# EAGLE design power (EAGLE 6.4)
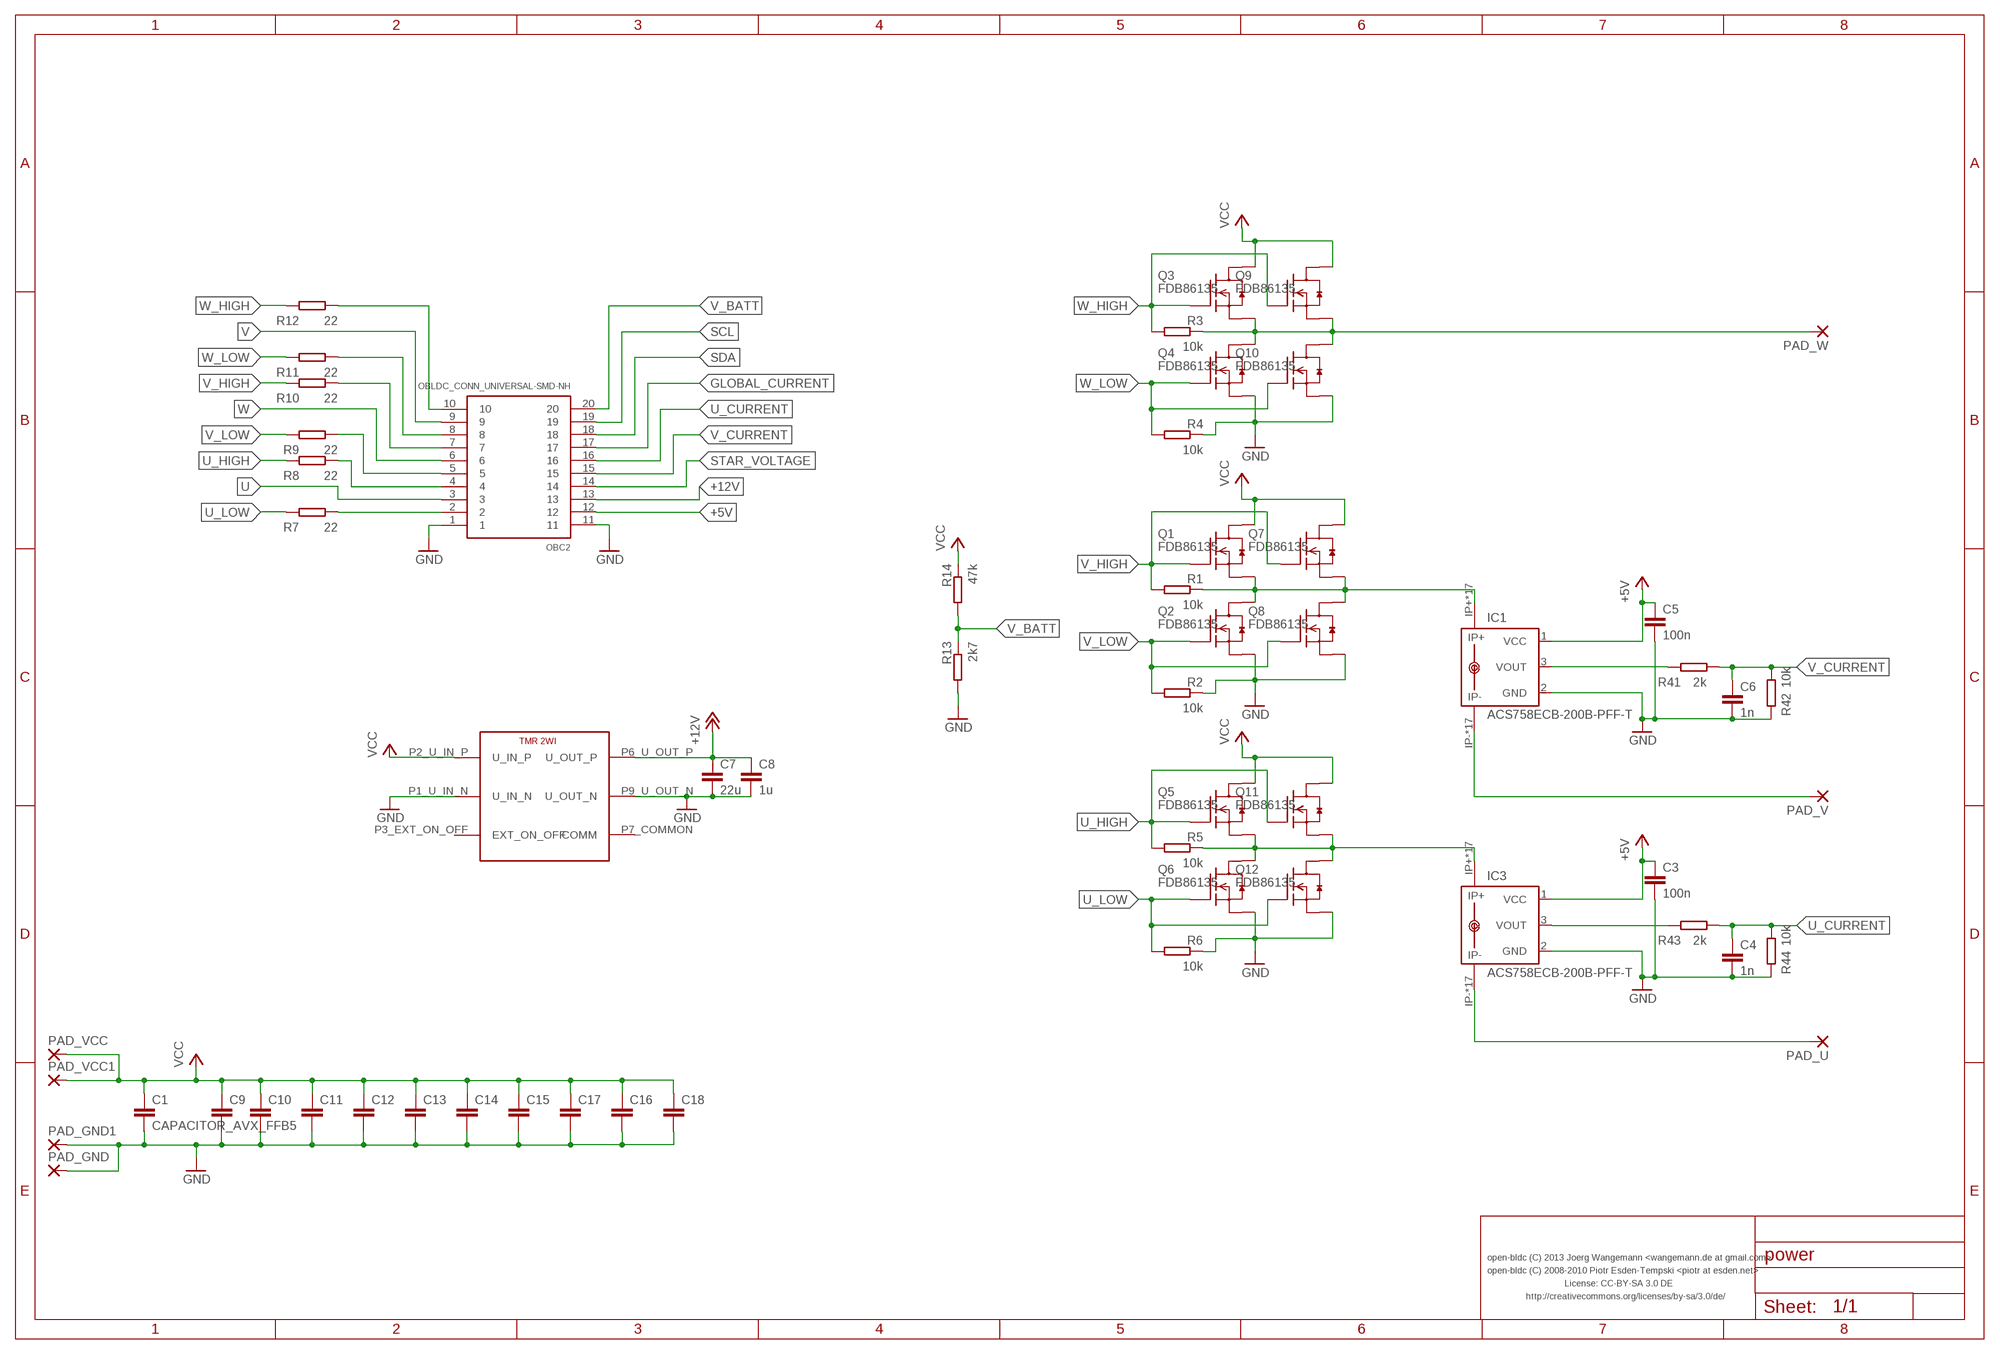
[diagram p0: schematic, sheet 1]

## Parts
C1  CAPACITOR_AVX_FFB5  [AVX_FFB5]
C3  100n  CAPACITOR-0603  [0603-CAP]
C4  1n  CAPACITOR-0603  [0603-CAP]
C5  100n  CAPACITOR-0603  [0603-CAP]
C6  1n  CAPACITOR-0603  [0603-CAP]
C7  22u  C-EUC2220K  [C2220K]
C8  1u  C-EUC1206  [C1206]
C9  C-EUC2220K  [C2220K]
C10  C-EUC2220K  [C2220K]
C11  C-EUC2220K  [C2220K]
C12  C-EUC2220K  [C2220K]
C13  C-EUC2220K  [C2220K]
C14  C-EUC2220K  [C2220K]
C15  C-EUC2220K  [C2220K]
C16  C-EUC2220K  [C2220K]
C17  C-EUC2220K  [C2220K]
C18  C-EUC2220K  [C2220K]
IC1  ACS758ECB-200B-PFF-T  [CB-PFF]
IC3  ACS758ECB-200B-PFF-T  [CB-PFF]
OBC2  OBLDC_CONN_UNIVERSAL-SMD-NH  [OBLDC_CONN_SMD_NO_HOLES]
PAD_GND  WIREPAD-2MM  [WIREPAD_2MM]
PAD_GND1  WIREPAD-2MM  [WIREPAD_2MM]
PAD_U  WIREPAD-2MM  [WIREPAD_2MM]
PAD_V  WIREPAD-2MM  [WIREPAD_2MM]
PAD_VCC  WIREPAD-2MM  [WIREPAD_2MM]
PAD_VCC1  WIREPAD-2MM  [WIREPAD_2MM]
PAD_W  WIREPAD-2MM  [WIREPAD_2MM]
Q1  FDB86135  [DPAK]
Q2  FDB86135  [DPAK]
Q3  FDB86135  [DPAK]
Q4  FDB86135  [DPAK]
Q5  FDB86135  [DPAK]
Q6  FDB86135  [DPAK]
Q7  FDB86135  [DPAK]
Q8  FDB86135  [DPAK]
Q9  FDB86135  [DPAK]
Q10  FDB86135  [DPAK]
Q11  FDB86135  [DPAK]
Q12  FDB86135  [DPAK]
R1  10k  RESISTOR-0603SF  [0603-SF-RES]
R2  10k  RESISTOR-0603SF  [0603-SF-RES]
R3  10k  RESISTOR-0603SF  [0603-SF-RES]
R4  10k  RESISTOR-0603SF  [0603-SF-RES]
R5  10k  RESISTOR-0603SF  [0603-SF-RES]
R6  10k  RESISTOR-0603SF  [0603-SF-RES]
R7  22  RESISTOR-1206  [1206-RES]
R8  22  RESISTOR-1206  [1206-RES]
R9  22  RESISTOR-1206  [1206-RES]
R10  22  RESISTOR-1206  [1206-RES]
R11  22  RESISTOR-1206  [1206-RES]
R12  22  RESISTOR-1206  [1206-RES]
R13  2k7  RESISTOR-1206  [1206-RES]
R14  47k  RESISTOR-1206  [1206-RES]
R41  2k  RESISTOR-0603  [0603-RES]
R42  10k  RESISTOR-0603  [0603-RES]
R43  2k  RESISTOR-0603  [0603-RES]
R44  10k  RESISTOR-0603  [0603-RES]
U$2  TRACO_TMR_2WI  [TRACO_TMR_2WI]

## Nets
+5V: C3.P$1 C5.P$1 IC1.1(VCC) IC3.1(VCC) OBC2.12
+12V: C7.1 C8.1 OBC2.13 U$2.P6_U_OUT_P(U_OUT_P)
GLOBAL_CURRENT: OBC2.17
GND: C1.P$2 C3.P$2 C4.P$2 C5.P$2 C6.P$2 C7.2 C8.2 C9.2 C10.2 C11.2 C12.2 C13.2 C14.2 C15.2 C16.2 C17.2 C18.2 IC1.2(GND) IC3.2(GND) OBC2.1 OBC2.11 PAD_GND1.1(P) PAD_GND.1(P) Q2.3(S) Q4.3(S) Q6.3(S) Q8.3(S) Q10.3(S) Q12.3(S) R2.1 R4.1 R6.1 R13.P$2 R42.P$2 R44.P$2 U$2.P1_U_IN_N(U_IN_N) U$2.P9_U_OUT_N(U_OUT_N)
N$2: IC1.3(VOUT) R41.P$2
N$4: OBC2.2 R7.P$1
N$5: OBC2.4 R8.P$1
N$6: OBC2.5 R9.P$1
N$7: OBC2.7 R10.P$1
N$8: OBC2.8 R11.P$1
N$9: OBC2.10 R12.P$1
N$12: IC3.3(VOUT) R43.P$2
SCL: OBC2.19
SDA: OBC2.18
STAR_VOLTAGE: OBC2.14
U: IC3.IP+ IC3.IP+@2(IP+) IC3.IP+@3(IP+) IC3.IP+@4(IP+) IC3.IP+@5(IP+) IC3.IP+@6(IP+) IC3.IP+@7(IP+) IC3.IP+@8(IP+) IC3.IP+@9(IP+) IC3.IP+@10(IP+) IC3.IP+@11(IP+) IC3.IP+@12(IP+) IC3.IP+@13(IP+) IC3.IP+@14(IP+) IC3.IP+@15(IP+) IC3.IP+@16(IP+) IC3.IP+@17(IP+) OBC2.3 Q5.3(S) Q6.P$1(D) Q11.3(S) Q12.P$1(D) R5.1
U_CURRENT: C4.P$1 OBC2.16 R43.P$1 R44.P$1
U_HIGH: Q5.1(G) Q11.1(G) R5.2 R8.P$2
U_LOW: Q6.1(G) Q12.1(G) R6.2 R7.P$2
U_PAD: IC3.IP- IC3.IP-@2(IP-) IC3.IP-@3(IP-) IC3.IP-@4(IP-) IC3.IP-@5(IP-) IC3.IP-@6(IP-) IC3.IP-@7(IP-) IC3.IP-@8(IP-) IC3.IP-@9(IP-) IC3.IP-@10(IP-) IC3.IP-@11(IP-) IC3.IP-@12(IP-) IC3.IP-@13(IP-) IC3.IP-@14(IP-) IC3.IP-@15(IP-) IC3.IP-@16(IP-) IC3.IP-@17(IP-) PAD_U.1(P)
V: IC1.IP+ IC1.IP+@2(IP+) IC1.IP+@3(IP+) IC1.IP+@4(IP+) IC1.IP+@5(IP+) IC1.IP+@6(IP+) IC1.IP+@7(IP+) IC1.IP+@8(IP+) IC1.IP+@9(IP+) IC1.IP+@10(IP+) IC1.IP+@11(IP+) IC1.IP+@12(IP+) IC1.IP+@13(IP+) IC1.IP+@14(IP+) IC1.IP+@15(IP+) IC1.IP+@16(IP+) IC1.IP+@17(IP+) OBC2.9 Q1.3(S) Q2.P$1(D) Q7.3(S) Q8.P$1(D) R1.1
V_BATT: OBC2.20 R13.P$1 R14.P$2
V_CURRENT: C6.P$1 OBC2.15 R41.P$1 R42.P$1
V_HIGH: Q3.1(G) Q9.1(G) R3.2 R10.P$2
V_LOW: Q4.1(G) Q10.1(G) R4.2 R9.P$2
V_PAD: IC1.IP- IC1.IP-@2(IP-) IC1.IP-@3(IP-) IC1.IP-@4(IP-) IC1.IP-@5(IP-) IC1.IP-@6(IP-) IC1.IP-@7(IP-) IC1.IP-@8(IP-) IC1.IP-@9(IP-) IC1.IP-@10(IP-) IC1.IP-@11(IP-) IC1.IP-@12(IP-) IC1.IP-@13(IP-) IC1.IP-@14(IP-) IC1.IP-@15(IP-) IC1.IP-@16(IP-) IC1.IP-@17(IP-) PAD_V.1(P)
VCC: C1.P$1 C9.1 C10.1 C11.1 C12.1 C13.1 C14.1 C15.1 C16.1 C17.1 C18.1 PAD_VCC1.1(P) PAD_VCC.1(P) Q1.P$1(D) Q3.P$1(D) Q5.P$1(D) Q7.P$1(D) Q9.P$1(D) Q11.P$1(D) R14.P$1 U$2.P2_U_IN_P(U_IN_P)
W: OBC2.6 PAD_W.1(P) Q3.3(S) Q4.P$1(D) Q9.3(S) Q10.P$1(D) R3.1
W_HIGH: Q1.1(G) Q7.1(G) R1.2 R12.P$2
W_LOW: Q2.1(G) Q8.1(G) R2.2 R11.P$2
Unconnected: U$2.P3_EXT_ON_OFF(EXT_ON_OFF) U$2.P7_COMMON(COMM)

## Notes on the sheet
- open-bldc (C) 2013 Joerg Wangemann <wangemann.de at gmail.com>
- open-bldc (C) 2008-2010 Piotr Esden-Tempski <piotr at esden.net>
- License: CC-BY-SA 3.0 DE
- http://creativecommons.org/licenses/by-sa/3.0/de/

## Library data of the parts
C1 = open-bldc:CAPACITOR_AVX_FFB5
C3-C6 = pel_dipol_comp:CAPACITOR
C7-C18 = rcl:C-EU: CAPACITOR, European symbol
IC1 IC3 = allegro:ACS758*: Thermally Enhanced, Fully Integrated, Hall Effect-Based Linear Current Sensor with 100 micro Ohm Current Conductor display layer 49 Reference in BRD and place VIAs on circles Source: http://www.allegromicro.com/en/Products/Part_Numbers/0758/0758.pdf; MPN: ACS758ECB-200B-PFF-T; OC_FARNELL: 1718993; OC_NEWARK: 04R7127
OBC2 = open-bldc:OBLDC_CONN_UNIVERSAL
PAD_GND PAD_GND1 PAD_U PAD_V PAD_VCC PAD_VCC1 PAD_W = open-bldc:WIREPAD: THROUGH-HOLE PAD
Q1-Q12 = open-bldc:FDB86135
R1-R14 R41-R44 = pel_dipol_comp:RESISTOR
U$2 = open-bldc:TRACO_TMR_2WI: DC/DC Converter TRACO TMR 2WI Series

## Board
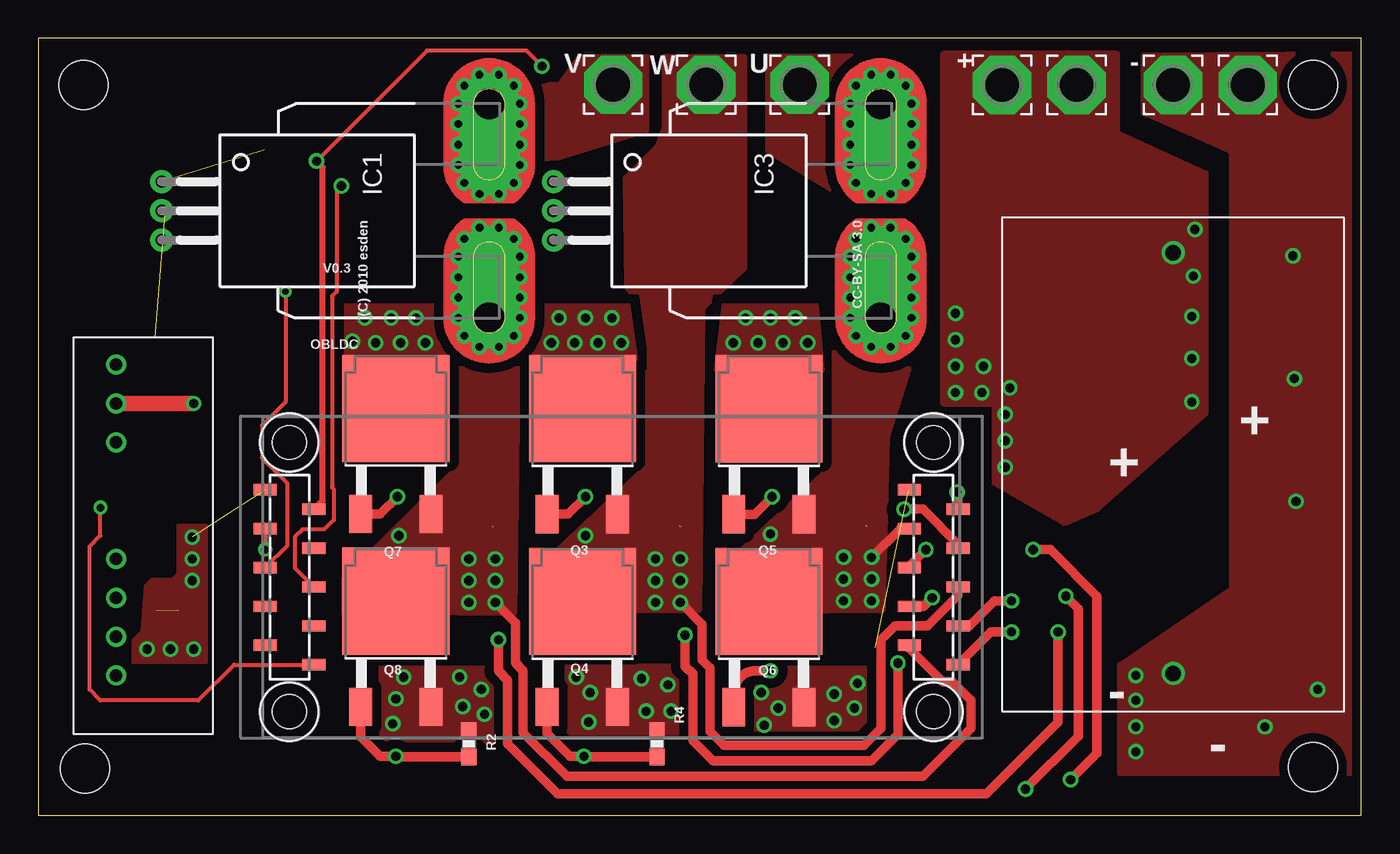
[diagram p1: board, top side]
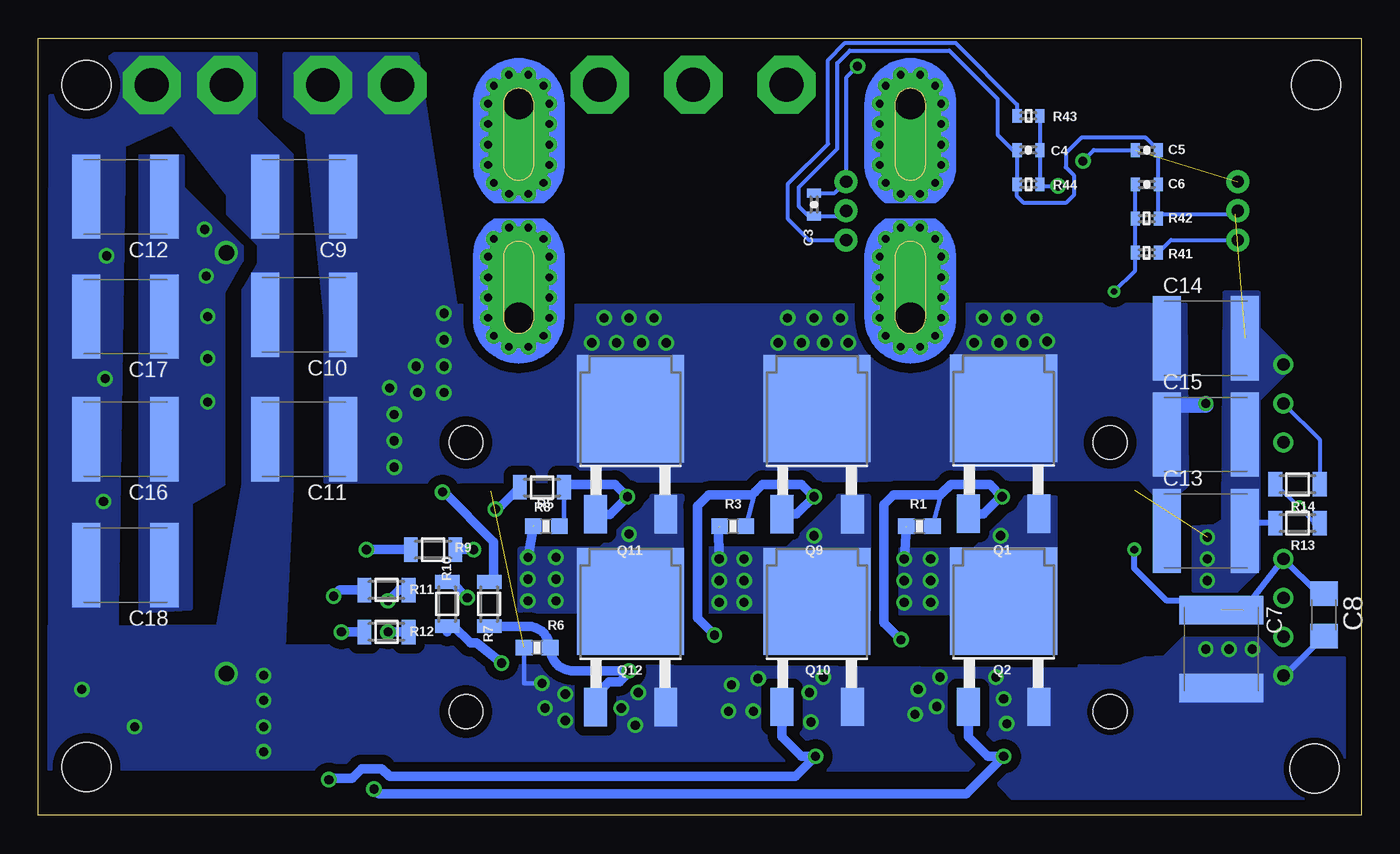
[diagram p2: board, bottom side, seen from below]

Size 86.46 x 50.8 mm. Coordinates in mm from the lower left corner, seen from the top.
Outline: 0,0 86.46,0 86.46,50.8 0,50.8 0,0
Copper layers (1*2+15*16): Top 0.035mm / dielectric 1.5mm / Route2 0.035mm / dielectric 0.15mm / Route15 0.035mm / dielectric 0.2mm / Bottom 0.035mm
Design rules "default": minimum track width 8mil, minimum drill 0.4mm, track to track 8mil, track to pad 8mil, pad to pad 8mil, via to via 8mil, smd to smd 8mil, copper to edge 10mil, drill to drill 8mil, minimum pad ring 10mil, minimum via ring 8mil, stop-mask expansion 4mil, vias tented up to drill 0.4mm, thermal gap 10mil
Holes 3.2 mm at 2.95,47.75 3.05,3.05 83.31,47.75 83.31,3.15

### Footprints (pad centres in the part's own frame; a part is rotated, then mirrored left to right if it is on the bottom)
AVX_FFB5 = drill 1: P$1 0,0; P$2 27.508,0
0603-CAP = smd 0.6 x 0.9: P$1 -0.75,0; P$2 0.75,0
C2220K = smd 1.85 x 5.5: 1 -2.55,0; 2 2.55,0
C1206 = smd 1.6 x 1.8: 1 -1.4,0; 2 1.4,0
CB-PFF = drill 0.8 pad 1.5: 1 -1.91,-21.4; 2 0,-21.4; 3 1.91,-21.4 | drill 2 pad 4 offset: IP+ 7,0; IP- -7,0 | drill 0.5 pad 0.9: IP+@2 8.89,0.635; IP+@3 8.89,-0.635; IP+@4 8.175,-1.625; IP+@5 7,-2; IP+@6 5.675,-2; IP+@7 4.35,-2; IP+@8 3,-2; IP+@9 1.825,-1.625; IP+@10 1.1,-0.625; IP+@11 1.1,0.625; IP+@12 1.825,1.625; IP+@13 3,2; IP+@14 4.35,2; IP+@15 5.675,2; IP+@16 7,2; IP+@17 8.175,1.625; IP-@2 -8.89,0.635; IP-@3 -8.89,-0.635; IP-@4 -8.175,-1.625; IP-@5 -7,-2; IP-@6 -5.675,-2; IP-@7 -4.325,-2; IP-@8 -3,-2; IP-@9 -1.825,-1.625; IP-@10 -1.1,-0.625; IP-@11 -1.1,0.625; IP-@12 -1.825,1.625; IP-@13 -3,2; IP-@14 -4.325,2; IP-@15 -5.675,2; IP-@16 -7,2; IP-@17 -8.175,1.625
OBLDC_CONN_SMD_NO_HOLES = smd 1.525 x 0.74: 1 43.727,16.2; 2 46.903,14.93; 3 43.727,13.66; 4 46.903,12.39; 5 43.727,11.12; 6 46.903,9.85; 7 43.727,8.58; 8 46.903,7.31; 9 43.727,6.04; 10 46.903,4.77; 11 1.624,16.2; 12 4.799,14.93; 13 1.624,13.66; 14 4.799,12.39; 15 1.624,11.12; 16 4.799,9.85; 17 1.624,8.58; 18 4.799,7.31; 19 1.624,6.04; 20 4.799,4.77
WIREPAD_2MM = drill 2.2 pad 3.81 octagon: 1 0,0
DPAK = smd 1.5 x 2.5: 1 -2.3,0; 3 2.3,0 | smd 7 x 7: P$1 0,6.9
0603-SF-RES = smd 1.1 x 1: 1 -0.85,0; 2 0.85,0
1206-RES = smd 0.9 x 1.6: P$1 -1.45,0; P$2 1.45,0
0603-RES = smd 0.6 x 0.9: P$1 -0.75,0; P$2 0.75,0
OBLDC_MECH = hole 2.2: 1.7,1.7; 1.7,19.3; 43.8,1.7; 43.8,19.3
TRACO_TMR_2WI = drill 0.8: P1_U_IN_N 0,0; P2_U_IN_P 2.54,0; P3_EXT_ON_OFF 5.08,0; P6_U_OUT_P 12.7,0; P7_COMMON 15.24,0; P8_NC 17.78,0; P9_U_OUT_N 20.32,0

### Placement (x,y rotation side)
C1  74.17,36.78 270 top
C3  35.76,39.93 270 bottom
C4  21.74,43.48 180 bottom
C5  14.02,43.48 0 bottom
C6  14.02,41.25 0 bottom
C7  9.14,10.87 270 bottom
C8  2.44,13.11 270 bottom
C9  69.09,40.44 180 bottom
C10  69.09,32.72 180 bottom
C11  69.09,24.59 180 bottom
C12  80.77,40.44 180 bottom
C13  10.16,18.59 0 bottom
C14  10.16,31.19 0 bottom
C15  10.16,24.89 0 bottom
C16  80.77,24.59 180 bottom
C17  80.77,32.61 180 bottom
C18  80.77,16.36 180 bottom
IC1  29.46,39.52 270 top
IC3  55.07,39.52 270 top
OBC2  13.21,5.08 0 top
PAD_GND  74.17,47.75 270 top
PAD_GND1  79.04,47.75 0 top
PAD_U  49.76,47.77 0 top
PAD_V  37.57,47.77 180 top
PAD_VCC  62.99,47.75 90 top
PAD_VCC1  67.87,47.75 0 top
PAD_W  43.66,47.77 90 top
Q1  23.37,19.71 0 bottom
Q2  23.37,7.1 0 bottom
Q3  35.56,19.69 0 top
Q4  35.56,7.09 0 top
Q5  47.75,19.68 0 top
Q6  47.75,7.08 0 top
Q7  23.37,19.71 0 top
Q8  23.37,7.1 0 top
Q9  35.56,19.69 0 bottom
Q10  35.56,7.09 0 bottom
Q11  47.75,19.68 0 bottom
Q12  47.75,7.08 0 bottom
R1  28.88,18.9 0 bottom
R2  28.14,4.67 270 top
R3  41.07,18.9 0 bottom
R4  40.44,4.67 270 top
R5  53.26,18.9 0 bottom
R6  53.87,10.97 0 bottom
R7  57,13.82 270 bottom
R8  53.54,21.44 0 bottom
R9  60.66,17.37 180 bottom
R10  59.74,13.82 270 bottom
R11  63.7,14.73 180 bottom
R12  63.7,11.99 180 bottom
R13  4.17,19.1 180 bottom
R14  4.17,21.64 180 bottom
R41  14.02,36.78 0 bottom
R42  14.02,39.01 0 bottom
R43  21.74,45.72 180 bottom
R44  21.74,41.25 180 bottom
U$1  [OBLDC_MECH]  14.71,5.08 0 top
U$2  5.08,29.46 270 top

### Tracks (layer width: path | path; a pad name or v marks a point on that pad's centre or on a via)
+5V  (via drill 0.6)  (1 unrouted)
  Top 0.254: v32.92,48.97 31.9,49.99 25.4,49.99 v18.19,42.77
  Top 0.406: OBC2.12 18.59,20.6 18.59,42.37 v18.19,42.77
  Bottom 0.254: v32.92,48.97 33.63,48.26 33.63,41.43 IC3.1 34.42,40.68 C3.P$1 | v18.19,42.77 17.48,43.48 C5.P$1
+12V  (via drill 0.5 pad 0.25)  (1 unrouted)
  Top 0.203: OBC2.13
  Top 0.406: v14.83,17.37 OBC2.13
  Bottom 0.203: C8.1 2.82,14.51 | C7.1 10.98,13.42 11.58,14.02
  Bottom 0.406: 2.82,14.51 U$2.P6_U_OUT_P 7.72,13.41 | 11.58,14.02 12.7,14.02 14.83,16.15 v14.83,17.37
GND  (via drill 0.6, 0.6 pad 0.25)  (3 unrouted)
  Top 0.406: 56.87,21.21 OBC2.1
  Bottom 0.203: U$2.P9_U_OUT_N 5,9.14
  Bottom 0.254: IC3.2 34.01,39.18 C3.P$2 36.13,39.18 36.78,39.83 36.78,41.05 34.24,43.59 34.24,49.17 33.43,49.99 26.92,49.99 23.77,46.84 23.77,44.5 22.76,43.48 C4.P$2 R44.P$2 22.49,40.48 22.05,40.03 19.3,40.03 18.8,40.54 18.8,41.86 19.3,42.37 19.3,43.28 18.29,44.3 14.08,44.3 C5.P$2 C6.P$2 R42.P$2 12.97,39.32 8.27,39.32 IC1.2
  Bottom 0.305: R6.1 54.72,8.64 v53.54,8.64
  Bottom 0.406: 5,9.14 C8.2 | R13.P$2 7.42,19.1
  other vias: 23.37,7.62 7.11,10.87 8.64,10.87 10.16,10.87 10.06,18.19 10.06,16.76 10.06,15.34 23.88,9.04 23.16,5.99 28.96,8.23 27.53,9.04 29.16,6.6 27.74,7.11 35.15,9.04 36.07,8.03 35.97,6.1 39.42,8.94 41.15,8.53 39.73,6.81 41.35,6.81 47.24,8.03 48.36,7.01 47.45,5.89 52.02,7.92 53.34,7.01 52.02,6.2 71.73,4.17 71.73,5.79 71.73,7.52 71.73,9.14 83.62,8.23 80.16,5.79 82.19,20.52 82.09,28.55 81.99,36.58
  pour Top (isolate 0.61, no thermals): 34.52,9.82 42.04,9.82 42.14,5.28 34.52,5.28
  pour Bottom (isolate 0.61, no thermals): 18.05,9.59 55.68,9.8 55.68,11.07 70.71,11.07 70.71,12.4 86.13,12.34 86.13,3.05 24.59,2.95 22.86,1.12 18.05,1.12
  pour Bottom (isolate 0.406, no thermals): 1.08,10.3 5.43,10.3 6.71,11.58 11.68,11.58 12.9,10.36 14.12,10.3 15.75,9.75 18.46,9.8 18.56,1.12 1.08,1.12
  pour Top (isolate 0.61, no thermals): 22.33,9.72 29.95,9.72 30.05,4.67 22.33,4.78
  pour Top (isolate 0.406): 6.2,9.96 6.2,11.48 6.81,12.09 7.01,15.04 7.42,15.44 8.74,15.44 9.14,15.85 9.14,19 10.97,19 10.97,9.96
  pour Bottom (no thermals): 6.71,34.24 6.71,31.9 4.78,29.97 4.78,29.06 6.71,27.13 6.71,16.05 8.13,14.63 10.97,14.63 10.97,18.9 9.55,19 9.04,19.3 8.94,34.24
  pour Top (isolate 0.61, no thermals): 46.61,9.72 54.13,9.72 54.23,5.18 46.61,5.18
  pour Top (isolate 0.61, no thermals): 72.24,49.68 86.26,49.78 86.16,2.74 70.71,2.74 70.71,9.86 78.03,14.83 78.03,43.38 72.24,45.92
  pour Bottom (isolate 0.61, no thermals): 81.38,11.07 85.75,11.07 85.65,47.04 81.58,49.68 81.48,49.78 72.24,49.78 72.24,45.52 69.9,43.18 69.9,21.44 70.41,10.97 74.98,10.87 73.05,21.64 73.05,34.34 72.03,36.07 72.03,37.29 74.07,39.32 74.07,40.54 77.72,45.21 80.87,43.79
N$2
  Bottom 0.254: R41.P$2 12.44,37.61 IC1.3
N$4  (via drill 0.6)
  Top 0.61: v60.05,21.13 60.11,21.07 OBC2.2
  Bottom 0.61: R7.P$1 56.69,15.57 56.69,17.88 59.94,21.13 v60.05,21.13
N$5  (via drill 0.6)
  Top 0.61: OBC2.4 60.11,17.71 57.81,20.02 v56.59,20.02
  Bottom 0.61: v56.59,20.02 56.42,20.02 R8.P$1
N$6  (via drill 0.6)
  Top 0.61: v58.01,17.37 56.93,16.3 OBC2.5
  Bottom 0.61: R9.P$1 v58.01,17.37
N$7  (via drill 0.6)
  Top 0.61: v58.42,14.22 57.86,13.66 OBC2.7
  Bottom 0.61: R10.P$1 59.46,15.27 v58.42,14.22
N$8  (via drill 0.6)
  Top 0.61: v63.6,14.02 62.48,14.02 60.85,12.39 OBC2.8
  Bottom 0.61: R11.P$1 62.89,14.73 v63.6,14.02
N$9  (via drill 0.6)
  Top 0.61: v63.6,11.99 R12.P$1 OBC2.10
  Bottom 0.61: R12.P$1 v63.6,11.99
N$12
  Bottom 0.254: IC3.3 36.09,37.61 37.49,39.01 37.49,41.25 34.85,43.89 34.85,49.38 33.73,50.49 26.52,50.49 22.49,46.47 R43.P$2
U  (via drill 0.6)  (1 unrouted)
  Top 0.61: OBC2.3 56.33,18.74 v54.46,16.87
  Bottom 0.61: 54.1,18.95 v54.46,16.87
  other vias: 47.85,18.39 52.63,16.87 52.63,15.44 52.63,14.02 54.46,15.44 54.46,14.02
  pour Top (isolate 0.61, no thermals): 57.3,30.58 55.47,24.79 55.17,13.41 44.7,13.31 44.7,16.15 51.82,22.76 51.92,29.46 52.12,30.68
  pour Bottom (isolate 0.61, no thermals): 54.97,17.37 54.97,13.41 44.4,13.41 44.4,20.83 46.33,20.83 46.33,20.73 49.68,17.37
U_CURRENT  (via drill 0.6)
  Top 0.254: v19.81,41.15 19.51,40.84 19.51,34.24 19.2,33.93 19.2,21.44 19.3,21.34 19.3,19.3 18.69,18.69 17.27,18.69 16.76,18.19 16.76,16.17 OBC2.16 18.08,14.93
  Bottom 0.254: R43.P$1 C4.P$1 R44.P$1 20.89,41.15 v19.81,41.15
U_HIGH  (via drill 0.6 pad 0.25)
  Top 0.61: Q5.1 46.81,19.68 v47.95,20.83
  Bottom 0.305: R5.2 52.09,19.22 R8.P$2
  Bottom 0.61: Q11.1 49.1,19.68 v47.95,20.83 48.77,21.64 51.89,21.64 R8.P$2
U_LOW  (via drill 0.6)
  Top 0.61: v47.85,9.45 46.84,9.45 arc90 45.52,8.13 45.52,7.14 arc-90 Q6.1
  Bottom 0.61: R7.P$2 54.62,12.37 arc90 R6.2 arc-90 51.5,9.45 v47.85,9.45 47.85,9.35 48.46,8.74 49.17,8.74 50.05,7.86 | Q12.1 50.05,7.86 | 50.05,7.86 arc90 49.99,7.93
U_PAD
  pour Top (isolate 0.61, rank 2, no thermals): 47.63,49.71 54.64,49.71 54.64,39.12 47.63,43.38
V  (via drill 0.6)  (1 unrouted)
  Top 0.61: v29.87,13.92 31.19,12.6 31.19,9.96 31.7,9.45 31.7,5.38 34.54,2.54 57.81,2.54 60.96,5.69 60.96,7.52 59.74,8.74 59.13,8.74 56.93,10.93 OBC2.9
  Bottom 0.61: 29.72,18.85 v29.87,16.76
  other vias: 29.87,15.34 28.14,13.92 28.14,15.34 28.14,16.76 23.57,18.29
  pour Top (isolate 0.61, no thermals): 31.9,31.29 31.29,27.94 31.09,13.21 20.02,13.31 20.02,15.44 27.43,22.76 27.43,29.06 27.33,30.89
  pour Bottom (isolate 0.61, no thermals): 30.58,17.27 30.58,13.31 20.02,13.31 20.02,20.73 21.95,20.73 21.95,20.62 25.3,17.27
V_BATT  (via drill 0.5 pad 0.25)
  Top 0.254: OBC2.20 12.8,9.86 10.46,7.52 4.06,7.52 3.35,8.23 3.35,17.58 4.06,18.29 v4.06,20.12
  Bottom 0.254: 3.05,19.1 v4.06,20.12 5.59,21.64
  Bottom 0.406: R13.P$1 3.05,19.1 | R14.P$2 5.59,21.64
V_CURRENT  (via drill 0.4)
  Top 0.254: v16.15,34.24 16.15,27.03 14.63,25.5 14.63,23.37 16.26,21.74 16.26,17.62 OBC2.15
  Bottom 0.254: v16.15,34.24 14.77,35.62 R41.P$1 R42.P$1 C6.P$1
V_HIGH  (via drill 0.6, 0.6 pad 0.25)
  Top 0.61: Q3.1 34.63,19.7 v35.76,20.83 | v42.27,11.79 42.27,9.75 42.77,9.25 42.77,4.88 44.09,3.56 54.46,3.56 56.18,5.28 v56.18,9.96
  Bottom 0.305: 39.62,21.14 R3.2
  Bottom 0.61: Q9.1 36.9,19.7 v35.76,20.83 36.58,21.64 39.12,21.64 39.62,21.14 39.83,20.93 42.67,20.93 43.38,20.22 43.38,12.9 v42.27,11.79 | 59.74,11.99 R10.P$2 59.31,12.37 58.22,11.28 57.81,11.28 v56.18,9.96
V_LOW  (via drill 0.6)
  Top 0.61: Q4.1 33.26,5.35 34.75,3.86 v35.66,3.86 35.66,3.82 R4.2 | v67.46,2.34 69.19,4.06 69.19,14.33 66.14,17.37 v65.02,17.37
  Bottom 0.61: Q10.1 37.86,5.15 36.58,3.86 v35.66,3.86 36.98,2.54 63.5,2.54 64.01,3.05 65.33,3.05 65.94,2.44 67.36,2.44 v67.46,2.34 | v65.02,17.37 R9.P$2
V_PAD
  pour Top (isolate 0.61, rank 2, no thermals): 30.15,49.1 31.29,49.07 32.31,47.85 34.04,47.85 35.36,49.68 39.8,49.71 39.8,44.7 31.27,42.06
VCC  (via drill 0.6, 0.6 pad 0.25)
  Top 1.016: U$2.P2_U_IN_P v10.16,26.92
  Bottom 0.254: U$2.P2_U_IN_P 2.72,24.56 R14.P$1
  Bottom 1.016: v10.16,26.92 10.16,26.82 12.7,26.82
  other vias: 45.42,30.89 47.04,30.89 48.67,30.89 50.29,30.89 46.23,32.51 47.85,32.51 49.48,32.51 33.53,30.89 35.05,30.89 36.58,30.89 38.1,30.89 34.04,32.51 37.49,32.51 35.76,32.51 20.52,30.99 22.05,30.89 23.67,30.89 25.3,30.89 24.69,32.51 23.06,32.51 21.34,32.51 59.94,32.82 59.94,31.09 59.94,29.36 61.77,29.36 59.94,27.64 61.67,27.64 63.5,27.94 63.2,26.21 63.2,24.49 63.2,22.76 61.77,29.36 75.59,38.3 75.49,35.26 75.39,32.61 75.39,29.87 75.39,27.03
  pour Top (isolate 0.61, no thermals): 44.78,33.4 50.88,33.4 51.28,29.06 44.27,29.06
  pour Bottom (isolate 0.61, no thermals): 11.45,33.43 59.13,33.32 61.67,49.78 70.41,49.78 70.41,45.62 68.99,44.7 67.74,32.61 67.74,21.77 14.53,21.95 13.61,21.03 11.89,21.03 11.34,21.57
  pour Top (isolate 0.61, no thermals): 33.1,33.4 38.58,33.4 39.09,29.77 32.28,29.87
  pour Top (isolate 0.61, no thermals): 19.79,33.4 25.78,33.4 26.8,29.77 19.89,29.87
  pour Top (isolate 0.61, no thermals): 70.51,49.78 59.13,49.78 59.13,26.92 62.48,26.92 62.48,21.74 67.06,19.1 69.19,20.02 76.3,26.31 76.3,41.96 70.51,44.6
  pour Bottom (isolate 0.61, no thermals): 79.86,43.08 77.01,43.08 77.01,41.05 73.15,37.19 73.15,36.27 74.37,34.14 74.37,21.64 76.5,20.42 76.5,13.51 79.76,13.31 79.76,42.98
W  (via drill 0.6)  (1 unrouted)
  Top 0.61: v41.96,13.92 43.38,12.5 43.38,10.16 43.89,9.65 43.89,5.49 44.81,4.57 53.95,4.57 55.07,5.69 55.07,11.48 55.98,12.39 58.11,12.39 60.11,14.39 OBC2.6
  Bottom 0.61: 42.01,18.85 v41.96,16.76
  other vias: 40.34,16.76 40.34,15.34 41.96,15.34 40.34,13.92 35.76,18.29
  pour Bottom (isolate 0.406, no thermals): 42.77,17.37 42.77,13.41 32.21,13.41 32.21,20.83 34.14,20.83 34.14,20.73 37.49,17.37
  pour Top (isolate 0.61, rank 2, no thermals): 46.13,49.58 46.13,35.76 43.38,33.12 43.18,13.41 32.61,13.41 32.61,16.05 39.62,22.66 39.62,33.02 38.51,34.54 38.4,41.66 40.54,43.79 40.94,44.91 40.94,49.58
W_HIGH  (via drill 0.6, 0.6 pad 0.25)
  Top 0.61: Q7.1 22.35,19.71 v23.47,20.83 | v30.07,11.48 30.07,9.45 30.68,8.84 30.68,4.67 33.93,1.42 61.98,1.42 66.65,6.1 v66.65,11.99
  Bottom 0.305: 27.43,21.04 R1.2
  Bottom 0.61: Q1.1 24.69,19.71 23.57,20.83 v23.47,20.83 24.28,21.64 26.82,21.64 27.43,21.04 27.53,20.93 30.58,20.93 31.19,20.32 31.19,12.6 v30.07,11.48 | v66.65,11.99 R12.P$2
W_LOW  (via drill 0.6)
  Top 0.61: R2.2 23.37,3.82 v23.37,3.86 22.35,3.86 21.07,5.15 Q8.1 | v64.52,1.73 67.97,5.18 67.97,13.51 v67.16,14.33
  Bottom 0.61: Q2.1 25.67,5.15 24.38,3.86 v23.37,3.86 25.81,1.42 64.21,1.42 v64.52,1.73 | v67.16,14.33 66.75,14.73 R11.P$2

### Text on the board
tPlace: V | W | U | + | - | V0.3 | (C) 2010 esden | CC-BY-SA 3.0 | OBLDC | + | + | - | -